# Altium schematic sheet SmartChess_map_SCH.SchDoc
size A
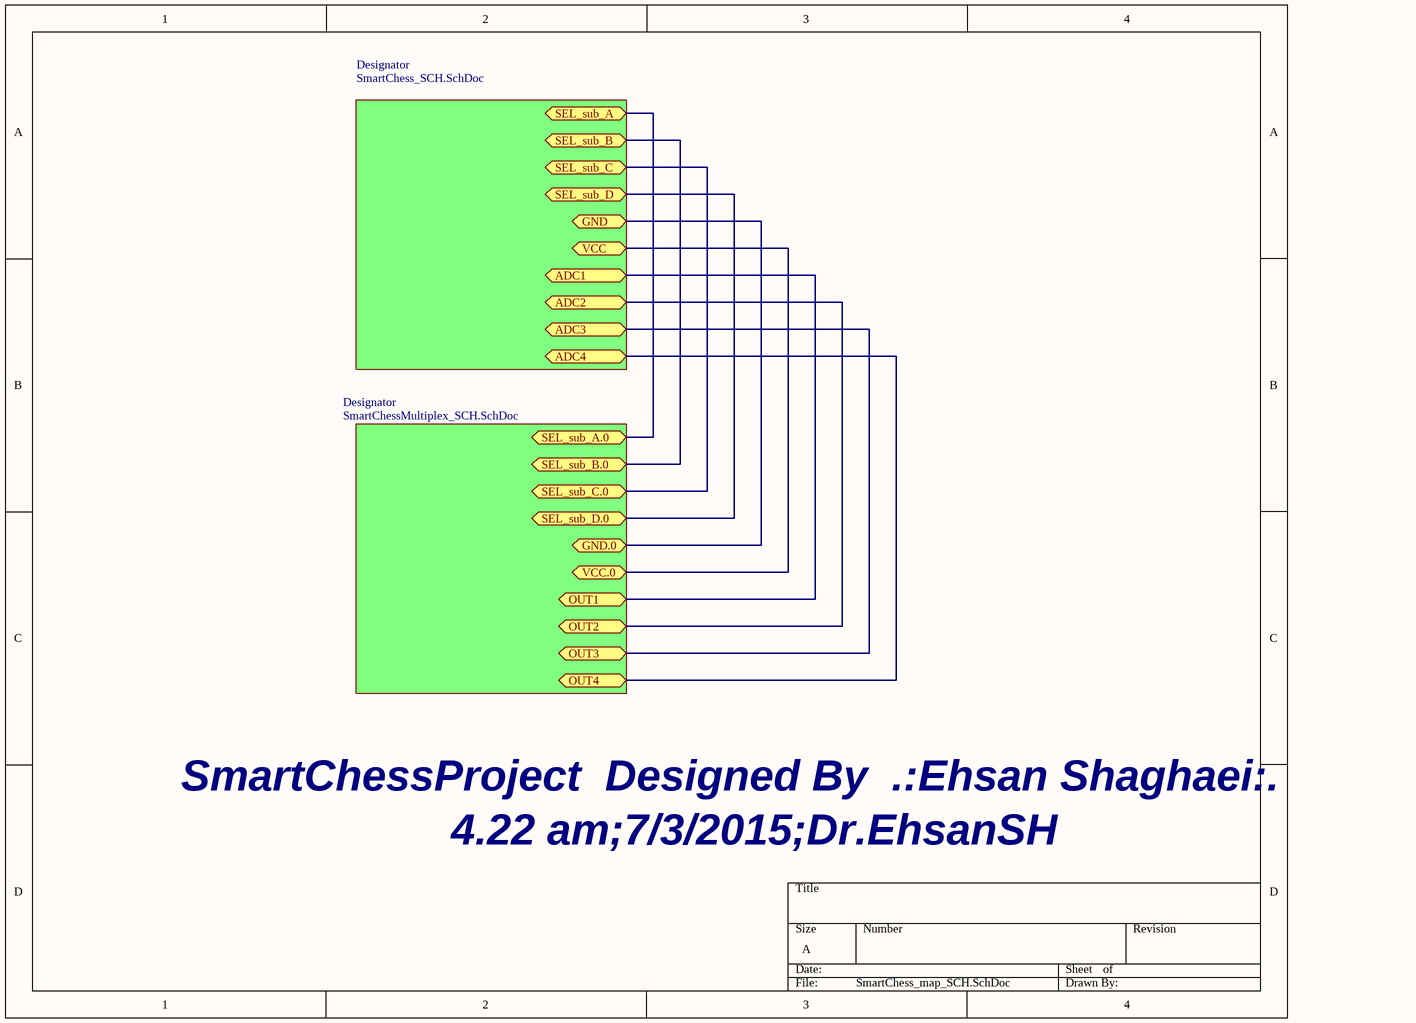
[diagram p0: SmartChess_map_SCH.SchDoc]

## Sub-sheets
Designator = SmartChess_SCH.SchDoc: no entries
Designator = SmartChessMultiplex_SCH.SchDoc: no entries

## Ports
ADC1 (bidir), ADC2 (bidir), ADC3 (bidir), ADC4 (bidir), GND (bidir), GND.0 (bidir), OUT1 (bidir), OUT2 (bidir), OUT3 (bidir), OUT4 (bidir), SEL_sub_A (bidir), SEL_sub_A.0 (bidir), SEL_sub_B (bidir), SEL_sub_B.0 (bidir), SEL_sub_C (bidir), SEL_sub_C.0 (bidir), SEL_sub_D (bidir), SEL_sub_D.0 (bidir), VCC (bidir), VCC.0 (bidir)

## Nets
ADC1: port OUT1, port ADC1
ADC2: port OUT2, port ADC2
ADC3: port OUT3, port ADC3
ADC4: port OUT4, port ADC4
GND: port GND.0, port GND
SEL_sub_A: port SEL_sub_A.0, port SEL_sub_A
SEL_sub_B: port SEL_sub_B.0, port SEL_sub_B
SEL_sub_C: port SEL_sub_C.0, port SEL_sub_C
SEL_sub_D: port SEL_sub_D.0, port SEL_sub_D
VCC: port VCC.0, port VCC

## Notes on the sheet
- SmartChessProject  Designed By  .:Ehsan Shaghaei:.
- 4.22 am;7/3/2015;Dr.EhsanSH